# Altium schematic sheet Buzz_AND_PINS.SchDoc
size A4; SheetNumber: 2; SheetTotal: 7
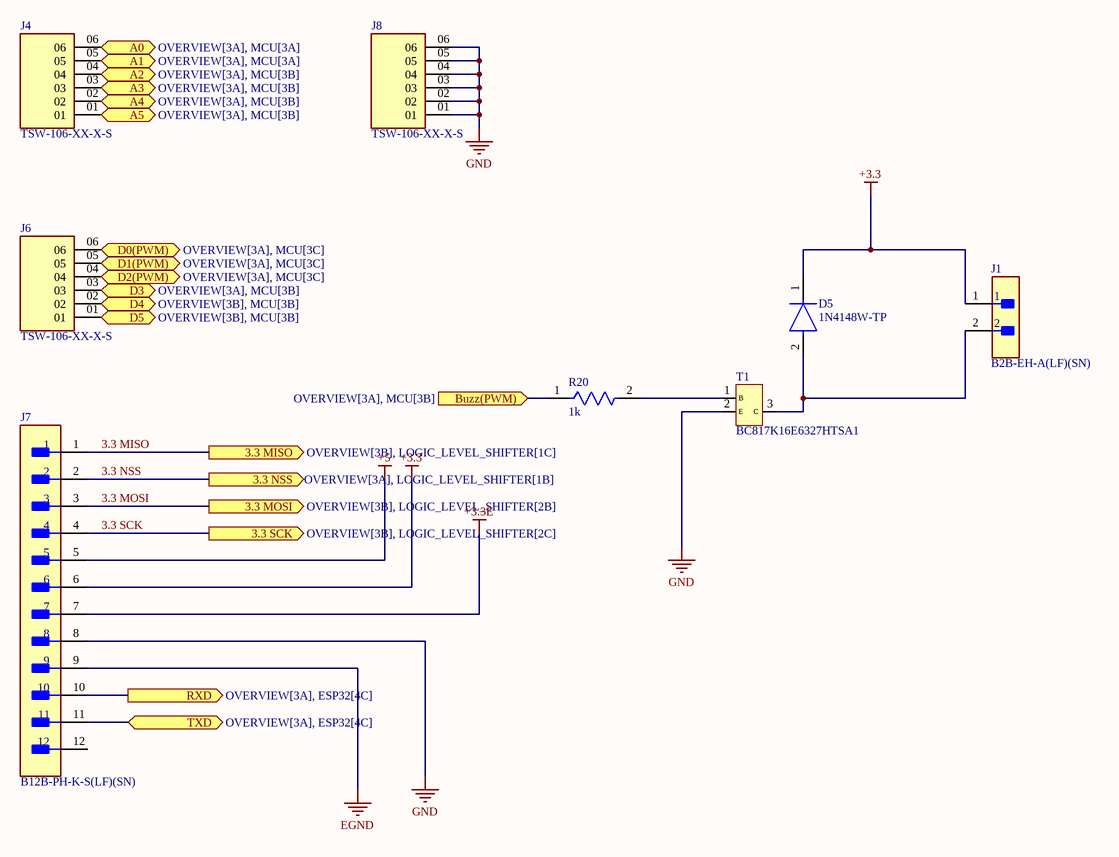
[diagram p0: Buzz_AND_PINS.SchDoc]

## Parts
D5  1N4148W-TP  [FP-SOD-123-IPC_A]
J1  B2B-EH-A(LF)(SN)  [FP-B2B-EH-A_LF_SN-MFG]
J4  TSW-106-XX-X-S  [SAMTEC_TSW-106-XX-X-S]
J6  TSW-106-XX-X-S  [SAMTEC_TSW-106-XX-X-S]
J7  B12B-PH-K-S(LF)(SN)  [FP-B12B-PH-K-S_LF_SN-MFG]
J8  TSW-106-XX-X-S  [SAMTEC_TSW-106-XX-X-S]
R20  1k  [FP-MCA1206-IPC_C]
T1  BC817K16E6327HTSA1  [SOT95P245X110-3N]

## Ports
3.3 MISO (out, see OVERVIEW[3B], LOGIC_LEVEL_SHIFTER[1C]), 3.3 MOSI (out, see OVERVIEW[3B], LOGIC_LEVEL_SHIFTER[2B]), 3.3 NSS (out, see OVERVIEW[3A], LOGIC_LEVEL_SHIFTER[1B]), 3.3 SCK (out, see OVERVIEW[3B], LOGIC_LEVEL_SHIFTER[2C]), A0 (bidir, see OVERVIEW[3A], MCU[3A]), A1 (bidir, see OVERVIEW[3A], MCU[3A]), A2 (bidir, see OVERVIEW[3A], MCU[3B]), A3 (bidir, see OVERVIEW[3A], MCU[3B]), A4 (bidir, see OVERVIEW[3A], MCU[3B]), A5 (bidir, see OVERVIEW[3A], MCU[3B]), Buzz(PWM) (in, see OVERVIEW[3A], MCU[3B]), D0(PWM) (bidir, see OVERVIEW[3A], MCU[3C]), D1(PWM) (bidir, see OVERVIEW[3A], MCU[3C]), D2(PWM) (bidir, see OVERVIEW[3A], MCU[3C]), D3 (bidir, see OVERVIEW[3A], MCU[3B]), D4 (bidir, see OVERVIEW[3B], MCU[3B]), D5 (bidir, see OVERVIEW[3B], MCU[3B]), RXD (out, see OVERVIEW[3A], ESP32[4C]), TXD (bidir, see OVERVIEW[3A], ESP32[4C])

## Nets
+3.3: D5.1(C) J1.1 J7.6
+3.3E: J7.7
+5: J7.5
EGND: J7.9
GND: J7.8 J8.01 J8.02 J8.03 J8.04 J8.05 J8.06 T1.2(E)
3.3 MISO: J7.1 ; port 3.3 MISO
3.3 MOSI: J7.3 ; port 3.3 MOSI
3.3 NSS: J7.2 ; port 3.3 NSS
3.3 SCK: J7.4 ; port 3.3 SCK
A0: J4.06 ; port A0
A1: J4.05 ; port A1
A2: J4.04 ; port A2
A3: J4.03 ; port A3
A4: J4.02 ; port A4
A5: J4.01 ; port A5
Buzz(PWM): R20.1 ; port Buzz(PWM)
D0(PWM): J6.06 ; port D0(PWM)
D1(PWM): J6.05 ; port D1(PWM)
D2(PWM): J6.04 ; port D2(PWM)
D3: J6.03 ; port D3
D4: J6.02 ; port D4
D5: J6.01 ; port D5
RXD: J7.10 ; port RXD
TXD: J7.11 ; port TXD
NetD5_2: D5.2(A) J1.2 T1.3(C)
NetR20_2: R20.2 T1.1(B)

Not connected (* = marked no-connect by the designer): J7 12

## Library data of the parts
D5 = CMP-2000-04993-2: DIODE GEN PURP 100V 150MA SOD123; Max Reverse Leakage Current: 5uA; Max Surge Current: 2A; Reverse Recovery Time: 4ns; Polarity: Standard; Capacitance: 4pF; Max Forward Surge Current (Ifsm): 1A; Element Configuration: Single; Power Dissipation: 400mW; Forward Voltage: 1V; Radiation Hardening: No; Lead Free: Lead Free; Max Reverse Voltage (DC): 100V; Current Rating: 150mA; Forward Current: 150mA; Packaging: Tape and Reel; Number of Pins: 2; Package Quantity: 3000; Max Operating Temperature: 150°C; Min Operating Temperature: -65°C; Average Rectified Current: 150mA; Recovery Time: 4ns; Output Current: 150mA; Peak Non-Repetitive Surge Current: 2A; Width: 1.8mm; Voltage Rating (DC): 100V; Height: 1.2mm; Max Repetitive Reverse Voltage (Vrrm): 100V; Mount: Surface Mount; Length: 2.85mm
J1 = CMP-17439-000026-1: CONN HEADER VERT 2POS 2.5MM; Number of Contacts: 2; Current Rating: 3A; Connector Type: Plug; Contact Resistance: 20mR; Gender: Male; Voltage Rating: 250V; Fastening Type: Detent; Depth: 3.8mm; Max Operating Temperature: 85°C; Orientation: Straight; Series: EH; Contact Plating: Tin; Min Operating Temperature: -25°C; Contact Type: Male Pin; Housing Color: White; Termination: Press-Fit; Housing Material: Nylon; Pitch: 2.5mm; Number of Positions: 2; Max Current Rating: 3A; Packaging: Bulk; Lead Free: Lead Free; Number of Rows: 1; Length: 7.5mm; Contact Mating Length: 0.13inch; Color: Natural; Max Voltage Rating (AC): 250V; Contact Material: Copper Alloy; Mount: Through Hole
J4 J6 J8 = TSW-106-XX-X-S: Connector Header Through Hole 6 position 0.100 (2.54mm); MF: Samtec; MP: TSW-106-26-T-S; SnapEDA_Link: https://www.snapeda.com/parts/TSW-106-26-T-S/Samtec/view-part/?ref=snap; Package: None; Value: *; Check_prices: https://www.snapeda.com/parts/TSW-106-26-T-S/Samtec/view-part/?ref=eda
J7 = CMP-17439-000219-1: CONN HEADER VERT 12POS 2MM; Working Voltage: 100V; Insulation Resistance: 1MR; Contact Resistance: 10mR; Mated Stacking Heights: 8mm; Number of Contacts: 12; Current Rating: 2A; Gender: Male; Connector Type: Header; Lead Pitch: 2mm; Insulation Color: Natural; Contact Material: Brass; Fastening Type: Detent; Contact Type: Male Pin; Height: 9.4mm; Pitch: 2mm; Length: 25.9mm; Voltage Rating (AC): 100V; Lead Free: Lead Free; Contact Mating Length: 0.13inch; Packaging: Bulk; Housing Color: Natural; Contact Shape: Square; Mount: Through Hole; Number of Positions: 12; Width: 4.5mm; Voltage Rating: 100V; Number of Pins: 12; Contact Plating: Tin; Number of Poles: 12; Insulation Material: Nylon; Contact Finish - Mating: TIN; Number of Rows: 1; Series: PH; Color: Natural; Termination: Press-Fit; Flammability Rating: UL94 V-0; REACH SVHC: No SVHC
R20 = CMP-02407-008870-1: Res MC Professional Thin Film 1206 1kΩ 1% 0.4W ±50ppm/°C Molded Paper T/R; Power Rating: 250mW; Voltage Rating: 200V; Resistance: 1kR; Tolerance: 1%; Military Standard: Not; Length: 3.2mm; Lead Free: Lead Free; Depth: 1.6mm; Height: 0.55mm; Case Code (Imperial): 1206; Packaging: Tape and Reel; Width: 1.6mm; Composition: Thin Film; Case Code (Metric): 3216; Package Quantity: 5000; Min Operating Temperature: -55°C; Case/Package: 1206; Weight: 0.000353oz; Max Operating Temperature: 125°C; Termination: SMD/SMT
T1 = BC817K16E6327HTSA1: Small Signal Bipolar Transistor, 0.5A I(C), 45V V(BR)CEO, 1-Element, NPN, Silicon; Manufacturer: Infineon; Package Body Material: Plastic; Max Collector Current: 500mA; DC Current Gain-Min (hFE): 100; Number of Elements: 1; Transistor Application: AMPLIFIER; Frequency: 170MHz; Reference Standard: AEC-Q101; Supplier: Arrow Electronics; Supplier Part Number: BC817K16E6327HTSA1; Manufacturer Part Number: BC817K16E6327HTSA1; RoHS: Yes; Category: BJTs; Stock: 27000; Pricing: 3000=0.0597, 6000=0.055, 9000=0.0544, 12000=0.054, 15000=0.0534, 30000=0.0512 (USD); Pins: 3; Package Shape: Rectangular; Transistor Element Material: SILICON; Polarity/Channel Type: NPN; Collector-emitter Voltage-Max: 45V; JESD-30 Code: R-PDSO-G3; Moisture Sensitivity Level: 1; Package Style: SMALL OUTLINEMeter; Surface Mount: Yes; Terminal Form: Gull Wing; Terminal Position: DUAL; Reach SVHC Compliant: Yes; RoHS Compliant: Yes; ComponentLink1URL: https://datasheet.ciiva.com:443/pdfs/VipMasterIC/IC/INFN/INFNS16504/INFNS16504-1.pdf?src-supplier=IHS+Markit; ComponentLink1Description: https://datasheet.ciiva.com:443/pdfs/VipMasterIC/IC/INFN/INFNS16504/INFNS16504-1.pdf?src-supplier=IHS+Markit; ComponentLink2URL: https://datasheet.ciiva.com/25626/0900766b81073eee-25626027.pdf?src-supplier=Rs; ComponentLink2Description: https://datasheet.ciiva.com/25626/0900766b81073eee-25626027.pdf?src-supplier=Rs; ComponentLink3URL: https://datasheet.ciiva.com/11208/infineon-bc817kseries-bc818kseries-ds-v01-01-en-11208254.pdf?src-supplier=Avnet; ComponentLink3Description: https://datasheet.ciiva.com/11208/infineon-bc817kseries-bc818kseries-ds-v01-01-en-11208254.pdf?src-supplier=Avnet